# Altium schematic sheet 12V_Buck_For_5V_3V3.SchDoc
size 259 x 167 mm; SheetNumber: 3; SheetTotal: 15
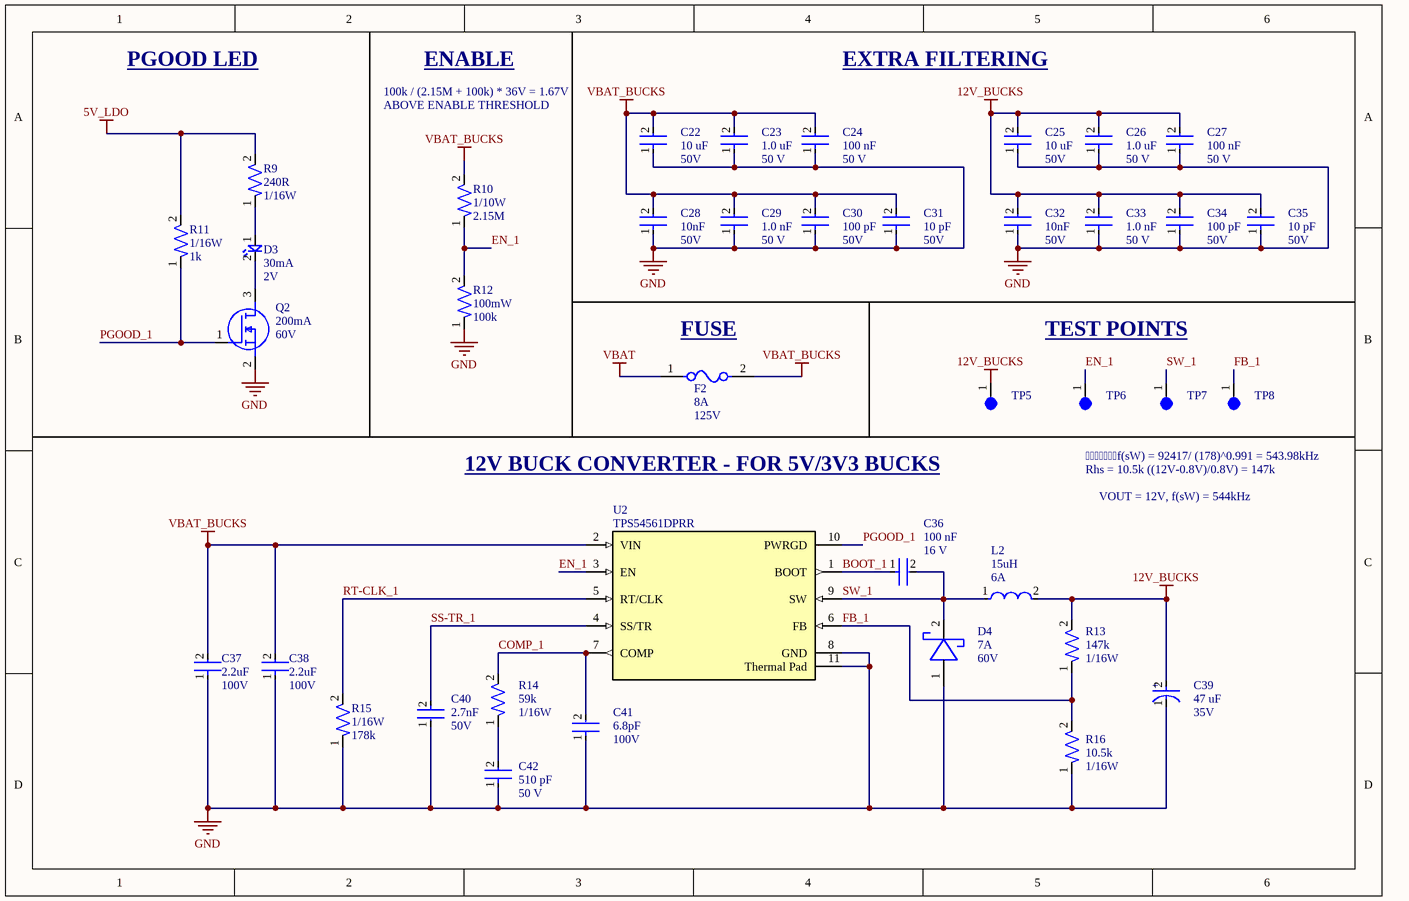
[diagram p0: 12V_Buck_For_5V_3V3.SchDoc]

## Parts
C22  Voltage: 50V  Capacitance: 10 uF  [CAP-1210]  (hidden comment: CL32B106KBJNNNE)
C23  Voltage: 50 V  Capacitance: 1.0 uF  [CAP-0805]  (hidden comment: CC0805KKX7R9BB105)
C24  Voltage Rating: 50 V  Capacitance: 100 nF  [CAP-0805]  (hidden comment: CC0805KRX7R9BB104)
C25  Voltage: 50V  Capacitance: 10 uF  [CAP-1210]  (hidden comment: CL32B106KBJNNNE)
C26  Voltage: 50 V  Capacitance: 1.0 uF  [CAP-0805]  (hidden comment: CC0805KKX7R9BB105)
C27  Voltage Rating: 50 V  Capacitance: 100 nF  [CAP-0805]  (hidden comment: CC0805KRX7R9BB104)
C28  Voltage: 50V  Capacitance: 10nF  [CAP-0805]  (hidden comment: GRM2195C1H103JA01D)
C29  Voltage: 50 V  Capacitance: 1.0 nF  [CAP-0402]  (hidden comment: CC0402KRX7R9BB102)
C30  Capacitance: 100 pF  Voltage: 50V  [CAP-0402]  (hidden comment: CC0402JRNPO9BN101)
C31  Capacitance: 10 pF  Voltage: 50V  [CAP-0402]  (hidden comment: CC0402JRNPO9BN100)
C32  Voltage: 50V  Capacitance: 10nF  [CAP-0805]  (hidden comment: GRM2195C1H103JA01D)
C33  Voltage: 50 V  Capacitance: 1.0 nF  [CAP-0402]  (hidden comment: CC0402KRX7R9BB102)
C34  Capacitance: 100 pF  Voltage: 50V  [CAP-0402]  (hidden comment: CC0402JRNPO9BN101)
C35  Capacitance: 10 pF  Voltage: 50V  [CAP-0402]  (hidden comment: CC0402JRNPO9BN100)
C36  Voltage Rating: 16 V  Capacitance: 100 nF  [CAP-0402]  (hidden comment: CC0402KRX7R7BB104)
C37  Capacitance: 2.2uF  Voltage: 100V  [CAP-1206]  (hidden comment: CC1206KKX7R0BB225)
C38  Capacitance: 2.2uF  Voltage: 100V  [CAP-1206]  (hidden comment: CC1206KKX7R0BB225)
C39  Voltage: 35V  Capacitance: 47 uF  [CAP_EEHZC1V470P]  (hidden comment: EEH-ZC1V470P)
C40  Voltage: 50V  Capacitance: 2.7nF  [CAP-0805]  (hidden comment: GRM2165C1H272JA01D)
C41  Voltage: 100V  Capacitance: 6.8pF  [CAP-0603]  (hidden comment: CC0603CRNPO0BN6R8)
C42  Voltage: 50 V  Capacitance: 510 pF  [CAP-0402]  (hidden comment: 0402N511J500CT)
D3  Forward Current: 30mA  Forward Voltage: 2V  [LED-0603]  (hidden comment: BL-HKC36G-AV-TRB)
D4  Forward Current: 7A  Reverse Voltage (DC): 60V  [DO-POWERDI5]  (hidden comment: PDS760-13)
F2  Fuse Current: 8A  Voltage Rating: 125V  [FUSE-0001]  (hidden comment: 01550900M)
L2  Inductance: 15uH  Current Rating: 6A  [IND-15U-0002]  (hidden comment: CSAD1010-150M)
Q2  Continuous Current: 200mA  Voltage: 60V  [IC-SOT23-3]  (hidden comment: T2N7002AK,LM)
R9  Resistance: 240R  Power: 1/16W  [RES-0402]  (hidden comment: RC0402FR-07240RL)
R10  Power: 1/10W  Resistance: 2.15M  [RES-0603]  (hidden comment: RC0603FR-072M15L)
R11  Power: 1/16W  Resistance: 1k  [RES-0402]  (hidden comment: RC0402FR-071KL)
R12  Power: 100mW  Resistance: 100k  [RES-0603]  (hidden comment: RC0603FR-07100KL)
R13  Power: 1/16W  Resistance: 147k  [RES-0402]  (hidden comment: RC0402FR-07147KL)
R14  Power: 1/16W  Resistance: 59k  [RES-0402]  (hidden comment: RC0402FR-0759KL)
R15  Power: 1/16W  Resistance: 178k  [RES-0402]  (hidden comment: RTT021783FTH)
R16  Power: 1/16W  Resistance: 10.5k  [RES-0402]  (hidden comment: RC0402FR-0710K5L)
TP5  5003  [TEST-POINT-0001]  (value not drawn)
TP6  5003  [TEST-POINT-0001]  (value not drawn)
TP7  5003  [TEST-POINT-0001]  (value not drawn)
TP8  5003  [TEST-POINT-0001]  (value not drawn)
U2  TPS54561DPRR  [IC-10WSON]

## Nets
5V_LDO: R9.2 R11.2
12V_BUCKS: C25.2 C26.2 C27.2 C32.2 C33.2 C34.2 C35.2 C39.2(A) L2.2 R13.2 TP5.1
GND: C22.1 C23.1 C24.1 C25.1 C26.1 C27.1 C28.1 C29.1 C30.1 C31.1 C32.1 C33.1 C34.1 C35.1 C37.1 C38.1 C39.1(C) C40.1 C41.1 C42.1 D4.1(CATHODE) Q2.2(S) R12.1 R15.1 R16.1 U2.8(GND) U2.11(Thermal_Pad)
VBAT: F2.1
VBAT_BUCKS: C22.2 C23.2 C24.2 C28.2 C29.2 C30.2 C31.2 C37.2 C38.2 F2.2 R10.2 U2.2(VIN)
BOOT_1: C36.1 U2.1(BOOT)
COMP_1: C41.2 R14.2 U2.7(COMP)
EN_1: R10.1 R12.2 TP6.1 U2.3(EN)
FB_1: R13.1 R16.2 TP8.1 U2.6(FB)
PGOOD_1: Q2.1(G) R11.1 U2.10(PWRGD)
RT-CLK_1: R15.2 U2.5(RT/CLK)
SS-TR_1: C40.2 U2.4(SS/TR)
SW_1: C36.2 D4.2(ANODE) L2.1 TP7.1 U2.9(SW)
NetC42_2: C42.2 R14.1
NetD3_1: D3.1 R9.1
NetD3_2: D3.2 Q2.3(D)

## Notes on the sheet
- PGOOD LED
- 100k / (2.15M + 100k) * 36V = 1.67V
- ABOVE ENABLE THRESHOLD
- ENABLE
- EXTRA FILTERING
- (near F2) FUSE
- TEST POINTS
- 12V BUCK CONVERTER - FOR 5V/3V3 BUCKS
- Rhs = 10.5k ((12V-0.8V)/0.8V) = 147k
- f(sW) = 92417/ (178)^0.991 = 543.98kHz
- VOUT = 12V, f(sW) = 544kHz
- (in symbol CAP-47U-0003) +

## Library data of the parts
C22 C25 = CAP-10U-0002: CAP CER 10UF 50V X7R 1210; Device Class: Ceramic; Size: 1210; ComponentLink1Description: Datasheet; ComponentLink1URL: https://mm.digikey.com/Volume0/opasdata/d220001/medias/docus/41/CL32B106KBJNNNE_Spec.pdf
C23 C26 = CAP-1U-0001: CAP CER 1UF 50V X7R 0805; ComponentLink2URL: https://www.yageo.com/upload/media/product/productsearch/datasheet/mlcc/UPY-GPHC_X7R_6.3V-to-250V_24.pdf; ComponentLink2Description: Datasheet; Device Class: Ceramic; Size: 0805
C24 C27 = CAP-0.1U-0002: CAP CER 0.1UF 50V X7R 0805; ComponentLink2Description: Datasheet; ComponentLink2URL: https://www.yageo.com/upload/media/product/productsearch/datasheet/mlcc/UPY-GPHC_X7R_6.3V-to-250V_24.pdf; Device Class: Ceramic; Size: 0805
C28 C32 = CAP-10N-0001: CAP CER 10000PF 50V C0G/NP0 0805; Device Class: Ceramic; Size: 0805; ComponentLink1Description: Datasheet; ComponentLink1URL: https://search.murata.co.jp/Ceramy/image/img/A01X/G101/ENG/GRM2195C1H103JA01-01.pdf
C29 C33 = CAP-1N-0001: CAP CER 1000PF 50V X7R 0402; ComponentLink2Description: Datasheet; ComponentLink2URL: http://www.yageo.com/documents/recent/UPY-GP_NP0_16V-to-50V_16.pdf; Device Class: Ceramic; Size: 0402
C30 C34 = CAP-100P-0001: CAP CER 100PF 50V C0G/NPO 0402; Device Class: Ceramic; Size: 0402; ComponentLink1Description: Datasheet; ComponentLink1URL: https://www.yageo.com/upload/media/product/productsearch/datasheet/mlcc/UPY-GP_NP0_16V-to-50V_18.pdf
C31 C35 = CAP-10P-0001: CAP CER 10PF 50V C0G/NPO 0402; Device Class: Ceramic; Size: 0402; ComponentLink1Description: Datasheet; ComponentLink1URL: https://www.yageo.com/upload/media/product/productsearch/datasheet/mlcc/UPY-GP_NP0_16V-to-50V_18.pdf
C36 = CAP-0.1U-0001: CAP CER 0.1UF 16V X7R 0402; ComponentLink2Description: Datasheet; ComponentLink2URL: https://www.yageo.com/upload/media/product/productsearch/datasheet/mlcc/UPY-GPHC_X7R_6.3V-to-250V_24.pdf; Device Class: Ceramic; Size: 0402
C37 C38 = CAP-2.2U-0001: CAP CER 2.2UF 100V X7R 1206; Device Class: Ceramic; Size: 1206; ComponentLink1Description: Datasheet; ComponentLink1URL: https://www.yageo.com/upload/media/product/productsearch/datasheet/mlcc/UPY-GPHC_X7R_6.3V-to-250V_24.pdf
C39 = CAP-47U-0003: 47 µF 35 V Aluminum - Polymer Capacitors Radial, Can - SMD 60mOhm 4000 Hrs @ 125°C; Device Class: Electrolytic
C40 = CAP-2.7N-0001: CAP CER 2700PF 50V C0G/NP0 0805; ComponentLink1Description: Datasheet; ComponentLink1URL: https://search.murata.co.jp/Ceramy/image/img/A01X/G101/ENG/GRM2165C1H272JA01-01.pdf; Device Class: Ceramic; Size: 0805
C41 = CAP-6.8P-0001: CAP CER 6.8PF 100V C0G/NPO 0603; Device Class: Ceramic; ComponentLink1Description: Datasheet; ComponentLink1URL: https://www.yageo.com/upload/media/product/productsearch/datasheet/mlcc/UPY-GPHC_X7R_6.3V-to-250V_24.pdf; Size: 0603
C42 = CAP-510P-0001: CAP CER 510PF 50V C0G/NP0 0402; ComponentLink2Description: Datasheet; ComponentLink2URL: https://www.mouser.com/ProductDetail/Walsin/0402N511J500CT?qs=u16ybLDytRbq33ukPPRl4A%3D%3D&srsltid=AfmBOoq1-HCbTRqPV3GtwyI6lHLBf095DSA3Qg1Qkiix4a-obr82TmJ6; Device Class: Ceramic; Size: 0402
D3 = LED-0001: LED YELLOW CLEAR 0603 SMD; ComponentLink1Description: Datasheet; ComponentLink1URL: https://www.americanbrightled.com/pdffiles/led-components/smt/BL-HKC36G-AV-TRB.pdf
D4 = DIO-SCHOTTKY-0001: DIODE SCHOTTKY 60V 7A POWERDI5; ComponentLink1Description: Datasheet; ComponentLink1URL: https://www.diodes.com/assets/Datasheets/PDS760.pdf
F2 = FUSE-0001: FUSE BLOK CARTRIDGE 125V 10A SMD; ComponentLink2Description: Datasheet; ComponentLink2URL: https://www.littelfuse.com/~/media/electronics/datasheets/fuses/littelfuse_fuse_154_154t_154l_154tl_datasheet.pdf.pdf
L2 = IND-15U-0002-NoJLC: SMD MOLDING POWER CHOKE; ComponentLink1Description: Datasheet; ComponentLink1URL: https://www.digikey.com/en/products/detail/codaca/CSAD1010-150M/16633512?s=N4IgjCBcoBwAxVAYygMwIYBsDOBTANCAPZQDaIALHAExwDMEAuoQA4AuUIAymwE4CWAOwDmIAL6Ew1MAE5EIFJAw4CxMiGoy6AdmoUQhajGqa6BjTDp6zhywFY4c23UtOLFbVXPVtYK3e9dODsbdwA2OxgQZhB2Th4BEXFJTQhoBTQsPEISSHITS0do1g5Ibj4hUQkNOBhteTiygFVBfjYAeVQAWVx0bABXXlxzfs4AVoAJcwBbIU4wAMJp9AAPeYDq2hgo9MaQFrbOnr7B4cJRsoBBGbmyuwA6DcIAWmp5RT5%2B1VzyAMYxAFAA
Q2 = NMOS-200MA-0001: MOSFET N-CH 60V 200MA SOT23; ComponentLink1Description: Datasheet; ComponentLink1URL: https://toshiba.semicon-storage.com/info/T2N7002AK_datasheet_en_20150401.pdf?did=29712&prodName=T2N7002AK
R9 = RES-240-0001: 240R 0.063W 1% 0402 (1005 Metric)  SMD; Tolerance: 1%; Size: 0402; ComponentLink1Description: Datasheet; ComponentLink1URL: https://www.yageo.com/upload/media/product/products/datasheet/rchip/PYu-RC_Group_51_RoHS_L_12.pdf
R10 = RES-2.15M-0001: RES SMD 2.15M OHM 1% 1/10W 0603; Tolerance: 1%; Size: 0603; ComponentLink1Description: Datasheet; ComponentLink1URL: https://www.yageo.com/upload/media/product/products/datasheet/rchip/PYu-RC_Group_51_RoHS_L_12.pdf
R11 = RES-1k-0001: RES 1K OHM 1% 1/16W 0402; Tolerance: 1%; Size: 0402; ComponentLink1Description: Datasheet; ComponentLink1URL: https://www.yageo.com/upload/media/product/products/datasheet/rchip/PYu-RC_Group_51_RoHS_L_12.pdf
R12 = RES-100k-0001: RES SMD 100K OHM 1% 1/10W 0603; Tolerance: 1%; Size: 0603; ComponentLink1Description: Datasheet; ComponentLink1URL: https://www.yageo.com/upload/media/product/products/datasheet/rchip/PYu-RC_Group_51_RoHS_L_12.pdf
R13 = RES-147k-0001: RES 147K OHM 1% 1/16W 0402; Tolerance: 1%; Size: 0402; ComponentLink1Description: Datasheet; ComponentLink1URL: https://www.yageo.com/upload/media/product/products/datasheet/rchip/PYu-RC_Group_51_RoHS_L_12.pdf
R14 = RES-59k-0001: RES 59K OHM 1% 1/16W 0402; Tolerance: 1%; Size: 0402; ComponentLink1Description: Datasheet; ComponentLink1URL: https://www.digikey.com/en/products/detail/yageo/RC0402FR-0759KL/2827634?s=N4IgTCBcDaIEoGEAMAWJYBicC0SDsArAJwDSAMiALoC%2BQA
R15 = RES-178k-0001_1: 62.5mW Thick Film Resistors 50V ±100ppm/℃ ±1% 178kΩ 0402 Chip Resistor - Surface Mount ROHS; Tolerance: 1%; Size: 0402; ComponentLink1Description: Datasheet; ComponentLink1URL: https://www.lcsc.com/datasheet/lcsc_datasheet_2304140030_RALEC-RTT021783FTH_C102842.pdf
R16 = RES-10.5k-0001: RES 10.5K OHM 1% 1/16W 0402; Tolerance: 1%; Size: 0402; ComponentLink1Description: Datasheet; ComponentLink1URL: https://www.yageo.com/upload/media/product/products/datasheet/rchip/PYu-RC_Group_51_RoHS_L_12.pdf
TP5-TP8 = TEST-POINT-0001: Oranange PC Test Point, Miniature Phoisphor Bronze Silver Plating Through Hole Mounting Type
U2 = IC-BUCK-0001: IC REG BUCK ADJ 5A 10WSON; ComponentLink1Description: Datasheet; ComponentLink1URL: https://www.ti.com/general/docs/suppproductinfo.tsp?distId=10&gotoUrl=https%3A%2F%2Fwww.ti.com%2Flit%2Fgpn%2Ftps54561